# Altium project PCB_TinyCAN.PrjPcb
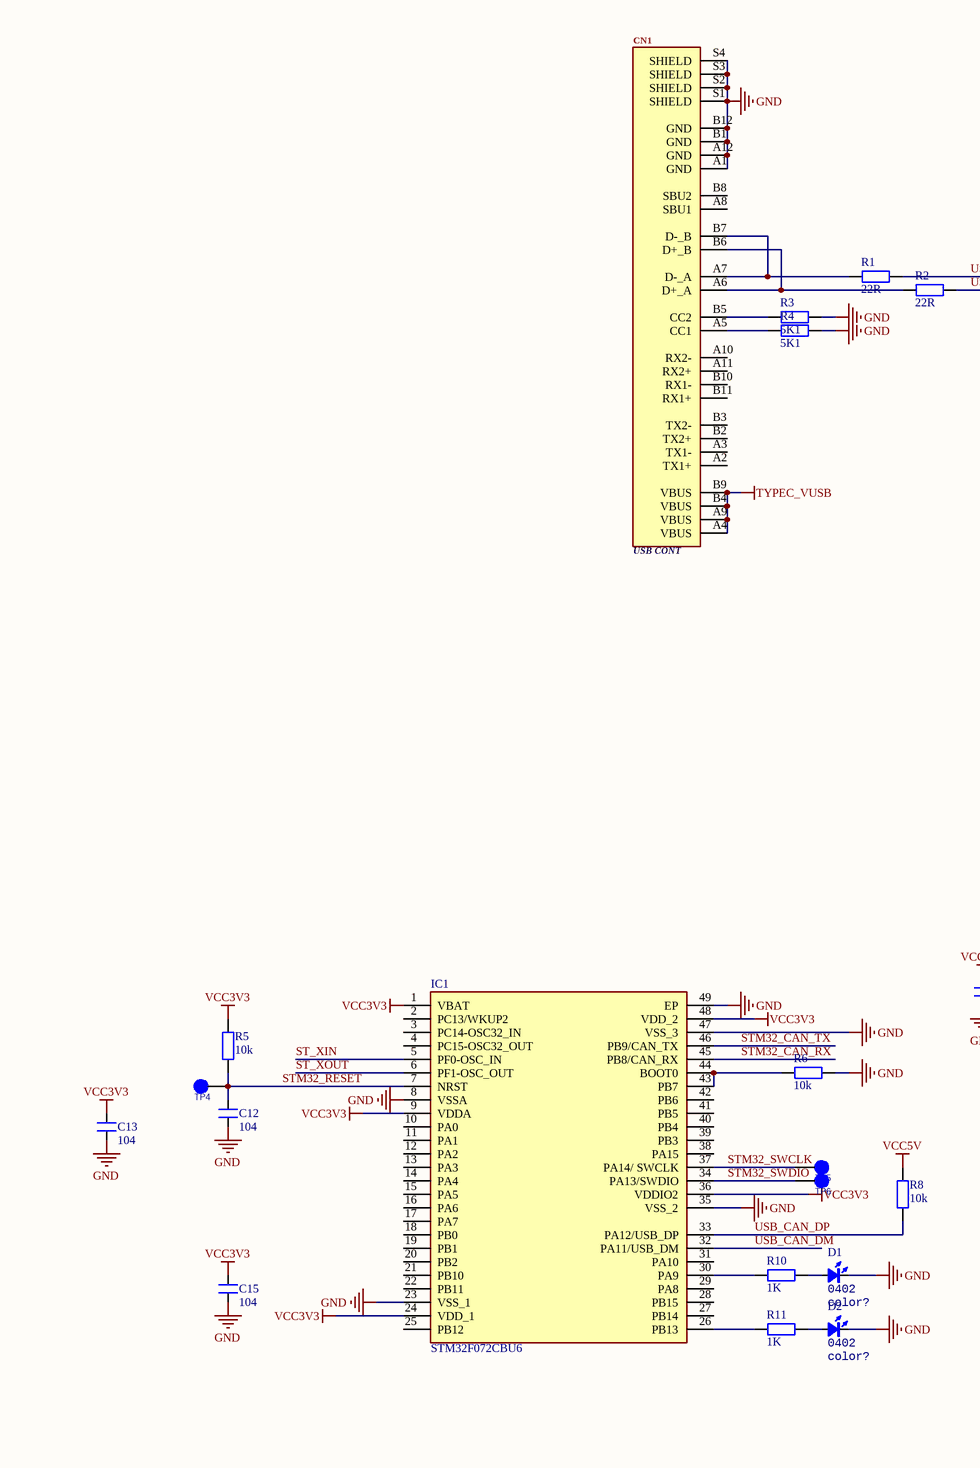
[diagram p0: TinyCAN.SchDoc, top left]
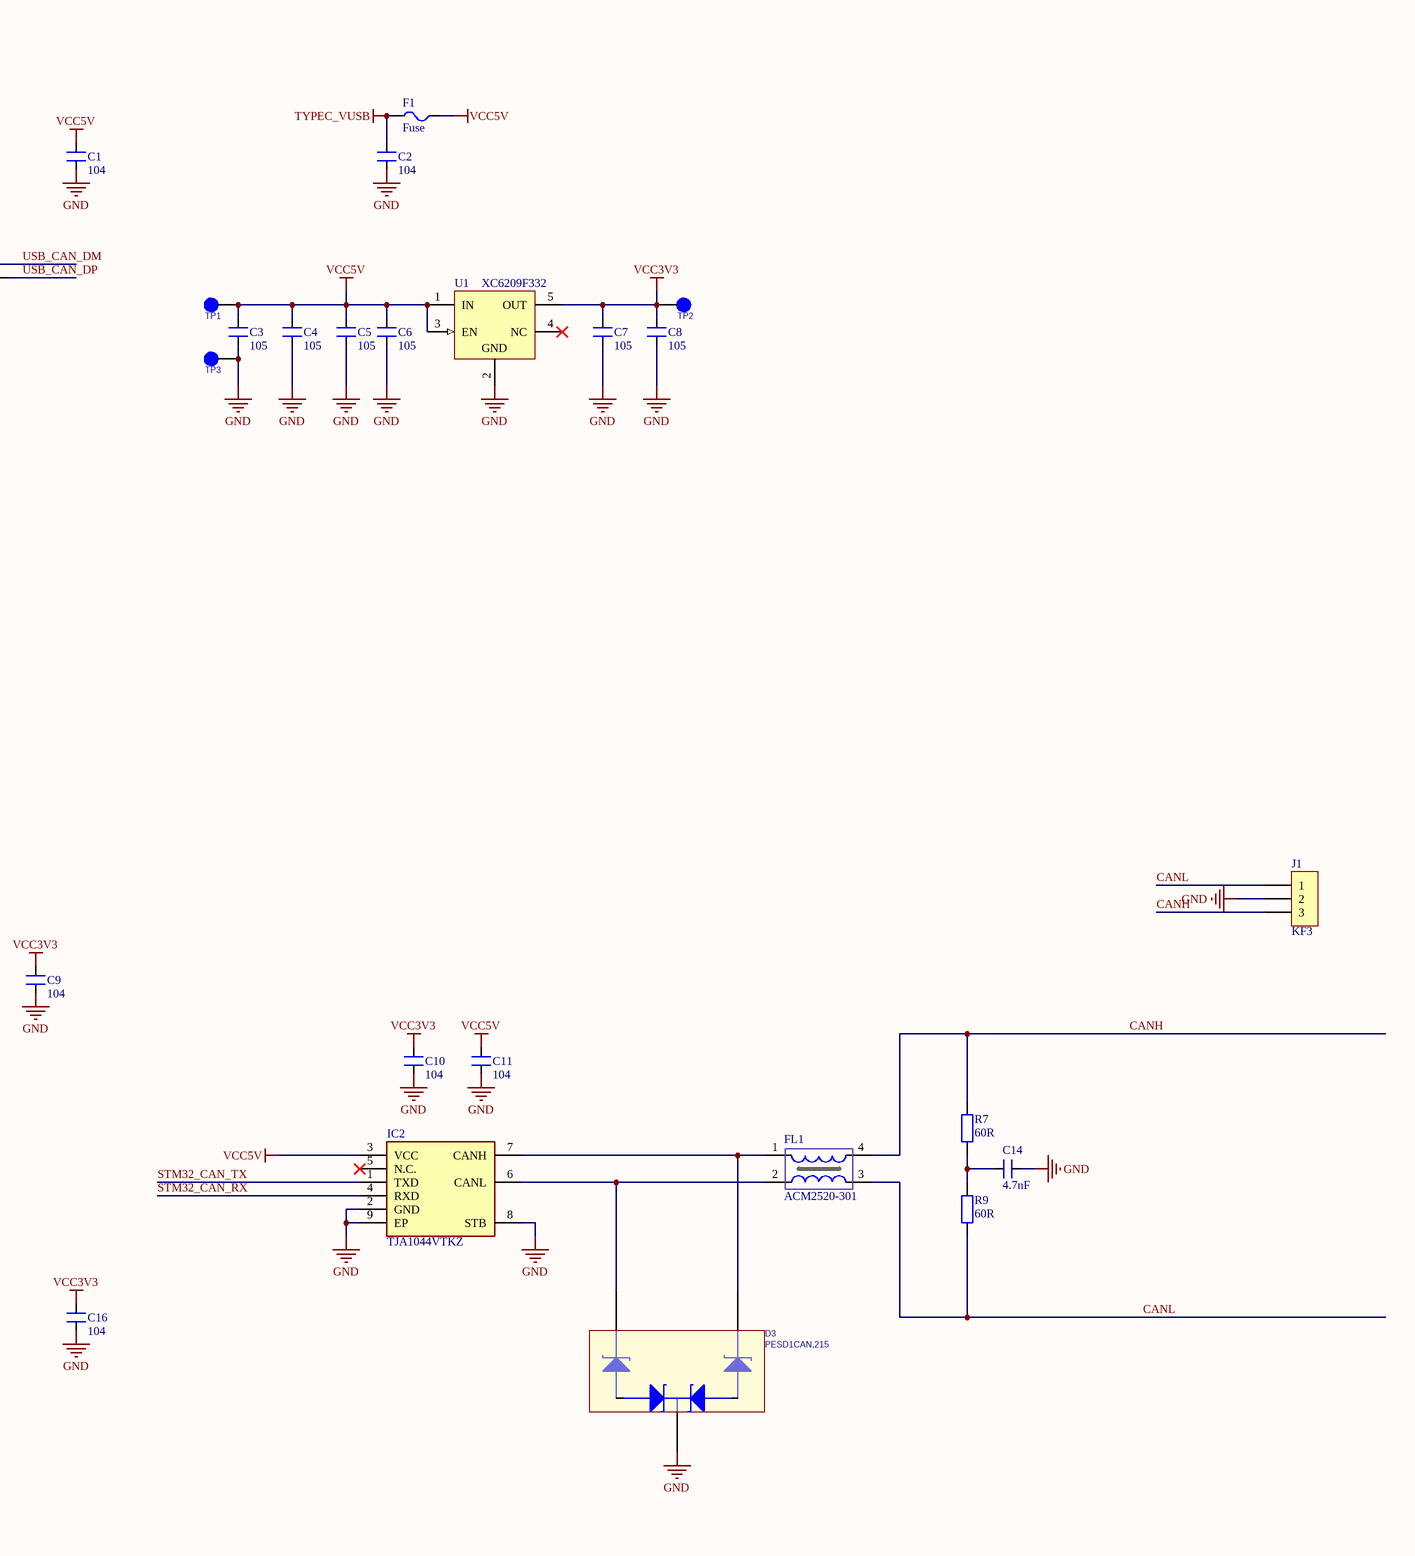
[diagram p1: TinyCAN.SchDoc, top right]
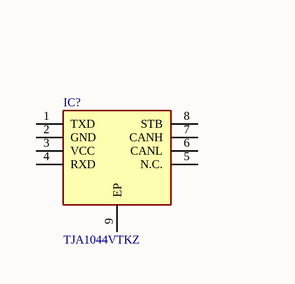
[diagram p2: TinyCAN.SchDoc, bottom left]
1 sheet, 44 parts. Net scope: global (net labels, ports and power ports of the same name join across sheets).
Board file: TinyCAN.PcbDoc

## Sheet TinyCAN.SchDoc
size A0; SheetNumber: 1; SheetTotal: 1

### Parts
C1  104  [CAP_0402]
C2  104  [C0402]
C3  105  [CAP_0402]
C4  105  [CAP_0402]
C5  105  [CAP_0402]
C6  105  [CAP_0402]
C7  105  [CAP_0402]
C8  105  [CAP_0402]
C9  104  [CAP_0402]
C10  104  [CAP_0402]
C11  104  [CAP_0402]
C12  104  [CAP_0402]
C13  104  [CAP_0402]
C14  4.7nF  [CAP_0402]
C15  104  [CAP_0402]
C16  104  [CAP_0402]
CN1  USB CONT  [MOLEX_1054550101]
D1  Type: 0402  [LED_0402_RED]  (hidden comment: color?)
D2  Type: 0402  [LED_0402_RED]  (hidden comment: color?)
D3  PESD1CAN,215  [SOT23-3]
F1  Fuse  [RES-SMD-0805]
FL1  ACM2520-301  [ACM25203012P]
IC1  STM32F072CBU6  [QFN50P700X700X60-49N-D]
IC2  TJA1044VTKZ  [SON65P300X300X100-9N]
IC?  TJA1044VTKZ  [SON65P300X300X100-9N]
J1  KF3  [KF3-3.5]
R1  22R  [RES_0402]
R2  22R  [RES_0402]
R3  5K1  [RES_0402]
R4  5K1  [RES_0402]
R5  10k  [RES_0402]
R6  10k  [RES_0402]
R7  60R  [RES-SMD-0603]
R8  10k  [RES_0402]
R9  60R  [RES-SMD-0603]
R10  1K  [RES_0402]
R11  1K  [RES_0402]
TP1  TP 1mm  [SMT Test Point]  (value not drawn)  (no BOM)
TP2  TP 1mm  [SMT Test Point]  (value not drawn)  (no BOM)
TP3  TP 1mm  [SMT Test Point]  (value not drawn)  (no BOM)
TP4  TP 1mm  [SMT Test Point]  (value not drawn)  (no BOM)
TP5  TP 1mm  [SMT Test Point]  (value not drawn)  (no BOM)
TP6  TP 1mm  [SMT Test Point]  (value not drawn)  (no BOM)
U1  XC6209F332  [SOT23-5]

### Nets
GND: C1.2 C2.2 C3.1 C4.1 C5.1 C6.1 C7.1 C8.1 C9.2 C10.2 C11.2 C12.2 C13.2 C14.1 C15.2 C16.2 CN1.A1(GND) CN1.A12(GND) CN1.B1(GND) CN1.B12(GND) CN1.S1(SHIELD) CN1.S2(SHIELD) CN1.S3(SHIELD) CN1.S4(SHIELD) D1.2(K) D2.2(K) D3.3(DK) IC1.8(VSSA) IC1.23(VSS_1) IC1.35(VSS_2) IC1.47(VSS_3) IC1.49(EP) IC2.2(GND) IC2.8(STB) IC2.9(EP) J1.2 R3.2 R4.2 R6.2 TP3.1(TP) U1.2(GND)
TYPEC_VUSB: C2.1 CN1.A4(VBUS) CN1.A9(VBUS) CN1.B4(VBUS) CN1.B9(VBUS) F1.1
VCC3V3: C7.2 C8.2 C9.1 C10.1 C13.1 C15.1 C16.1 IC1.1(VBAT) IC1.9(VDDA) IC1.24(VDD_1) IC1.36(VDDIO2) IC1.48(VDD_2) R5.1 TP2.1(TP) U1.5(OUT)
VCC5V: C1.1 C3.2 C4.2 C5.2 C6.2 C11.1 F1.2 IC2.3(VCC) R8.2 TP1.1(TP) U1.1(IN) U1.3(EN)
CANH: FL1.4 J1.3 R7.2
CANL: FL1.3 J1.1 R9.1
ST_XIN: IC1.5(PF0-OSC_IN)
ST_XOUT: IC1.6(PF1-OSC_OUT)
STM32_CAN_RX: IC1.45(PB8/CAN_RX) IC2.4(RXD)
STM32_CAN_TX: IC1.46(PB9/CAN_TX) IC2.1(TXD)
STM32_RESET: C12.1 IC1.7(NRST) R5.2 TP4.1(TP)
STM32_SWCLK: IC1.37(PA14/_SWCLK) TP5.1(TP)
STM32_SWDIO: IC1.34(PA13/SWDIO) TP6.1(TP)
USB_CAN_DM: IC1.32(PA11/USB_DM) R1.2
USB_CAN_DP: IC1.33(PA12/USB_DP) R2.2 R8.1
NetC14_2: C14.2 R7.1 R9.2
NetCN1_A5: CN1.A5(CC1) R4.1
NetCN1_A6: CN1.A6(D+_A) CN1.B6(D+_B) R2.1
NetCN1_A7: CN1.A7(D-_A) CN1.B7(D-_B) R1.1
NetCN1_B5: CN1.B5(CC2) R3.1
NetD1_1: D1.1(A) R10.2
NetD2_1: D2.1(A) R11.2
NetD3_1: D3.1(K1) FL1.1 IC2.7(CANH)
NetD3_2: D3.2(K2) FL1.2 IC2.6(CANL)
NetIC1_26: IC1.26(PB13) R11.1
NetIC1_30: IC1.30(PA9) R10.1
NetIC1_43: IC1.43(PB7) IC1.44(BOOT0) R6.1

Not connected (* = marked no-connect by the designer): CN1 A2(TX1+) A3(TX1-) A8(SBU1) A10(RX2-) A11(RX2+) B2(TX2+) B3(TX2-) B8(SBU2) B10(RX1-) B11(RX1+); IC1 2(PC13/WKUP2) 3(PC14-OSC32_IN) 4(PC15-OSC32_OUT) 10(PA0) 11(PA1) 12(PA2) 13(PA3) 14(PA4) 15(PA5) 16(PA6) 17(PA7) 18(PB0) 19(PB1) 20(PB2) 21(PB10) 22(PB11) 25(PB12) 27(PB14) 28(PB15) 29(PA8) 31(PA10) 38(PA15) 39(PB3) 40(PB4) 41(PB5) 42(PB6); IC2 5(N.C.)*; IC? 1(TXD) 2(GND) 3(VCC) 4(RXD) 5(N.C.) 6(CANL) 7(CANH) 8(STB) 9(EP); U1 4(NC)*

### Library data of the parts
C1-C16 = CM: Cap SMD; Value: 103
CN1 = 1054550101: CONN RCP USB3.1 TYPEC 24P SMD RA; Part Number: WM17904TR-ND; Manufacturer: Molex; Gender: Receptacle; MPN: 1054550101; Availability: Unavailable; Price: None; MF: Molex; Package: None
D1 D2 = LED_0402: LED; Value: color?
D3 = PESD5V0S2BT,215: TVS DIODE 5V 14V SOT23; Manufacturer: Nexperia USA Inc.; Manufacturer part #: PESD5V0S2BT,215; Indications: *; Created by: eteofilo; Creation date: 17-Apr-2018; Value: *; Modified by: *
FL1 = ACM2520-301-2PL-TL01_1: Common Mode Filters; Manufacturer_Name: TDK; Manufacturer_Part_Number: ACM9070-701-2PL-TL01; Datasheet Link: http://www.mouser.com/ds/2/400/e9713_acm-16715.pdf; Height: 4.5mm; Mouser Part Number: 810-ACM90707012PLTL; Mouser Price/Stock: https://www.mouser.co.uk/ProductDetail/TDK/ACM9070-701-2PL-TL01?qs=vGA93s6UehfkQlsVzBqdDg%3D%3D; Arrow Part Number: ACM9070-701-2PL-TL01; Arrow Price/Stock: https://www.arrow.com/en/products/acm9070-701-2pl-tl01/tdk
IC1 = STM32F072CBU6: Integrated Circuit; Manufacturer_Name: STMicroelectronics; Datasheet Link: https://www.mouser.com/datasheet/2/389/stm32f072c8-956183.pdf; Height: 0.6mm; Manufacturer_Part_Number: STM32F072CBU6; Mouser Part Number: 511-STM32F072CBU6; Mouser Price/Stock: https://www.mouser.co.uk/ProductDetail/STMicroelectronics/STM32F072CBU6?qs=xf9JV0PLFEfAjCpxuEsnYA%3D%3D; Arrow Part Number: STM32F072CBU6; Arrow Price/Stock: https://www.arrow.com/en/products/stm32f072cbu6/stmicroelectronics
IC2 IC? = TJA1044VTKZ: Integrated Circuit; Manufacturer_Name: NXP; Datasheet Link: http://www.nxp.com/docs/en/data-sheet/TJA1044V.pdf; Height: 1mm; Manufacturer_Part_Number: TJA1044VTKZ; Mouser Part Number: 771-TJA1044VTKZ; Mouser Price/Stock: https://www.mouser.co.uk/ProductDetail/NXP-Semiconductors/TJA1044VTKZ?qs=wUXugUrL1qx6DvcsX%252BFKdw%3D%3D; Arrow Part Number: TJA1044VTKZ; Arrow Price/Stock: https://www.arrow.com/en/products/tja1044vtkz/nxp-semiconductors?region=nac
J1 = KF3: Manufacturer: Würth Elektronik eiSos GmbH; partNo: 691103110003; ComponentLink1 Description: Manufacturer; ComponentLink2 Description: Datasheet; NoPins: 3; Created Date: 29 October 2013; ComponentLink1URL: http://www.we-online.com; ComponentLink2URL: http://katalog.we-online.de/em/datasheet/6911031100xx.pdf; Created by: Karrer Zheng
R1-R11 = R: Resistor R1/4W
TP1-TP6 = TP 1mm: PCB TEST POINT SMT 1mm; Manufacturer part #: *; DigiKey: *; Indications: *; Value: *; Modified by: *; Manufacturer: *; Created by: gmoreno; Creation date: 26-Apr-2012
U1 = XC6209F332MR-G: IC REG LINEAR 3.3V 300MA SOT25; MFR: Torex Semiconductor Ltd; Solder: SMT; PinCount: 5; ComponentLink1Description: Manufacturer URL; ComponentLink2URL: http://www.ti.com/general/docs/lit/getliterature.tsp?genericPartNumber=TLV70233&fileType=pdf; ComponentLink3URL: http://www.ti.com/litv/pdf/mpds018i; ComponentLink2Description: Datasheet; Value: XC6209F332; MPN: XC6209F332MR-G; ComponentLink1URL: http://www.ti.com/; ComponentLink3Description: Package Specification; Category: IC